# Altium schematic sheet Nixie tester.SchDoc: IN-18 Nixie Tube Tester
size 297 x 209 mm; SheetNumber: 1; SheetTotal: 1
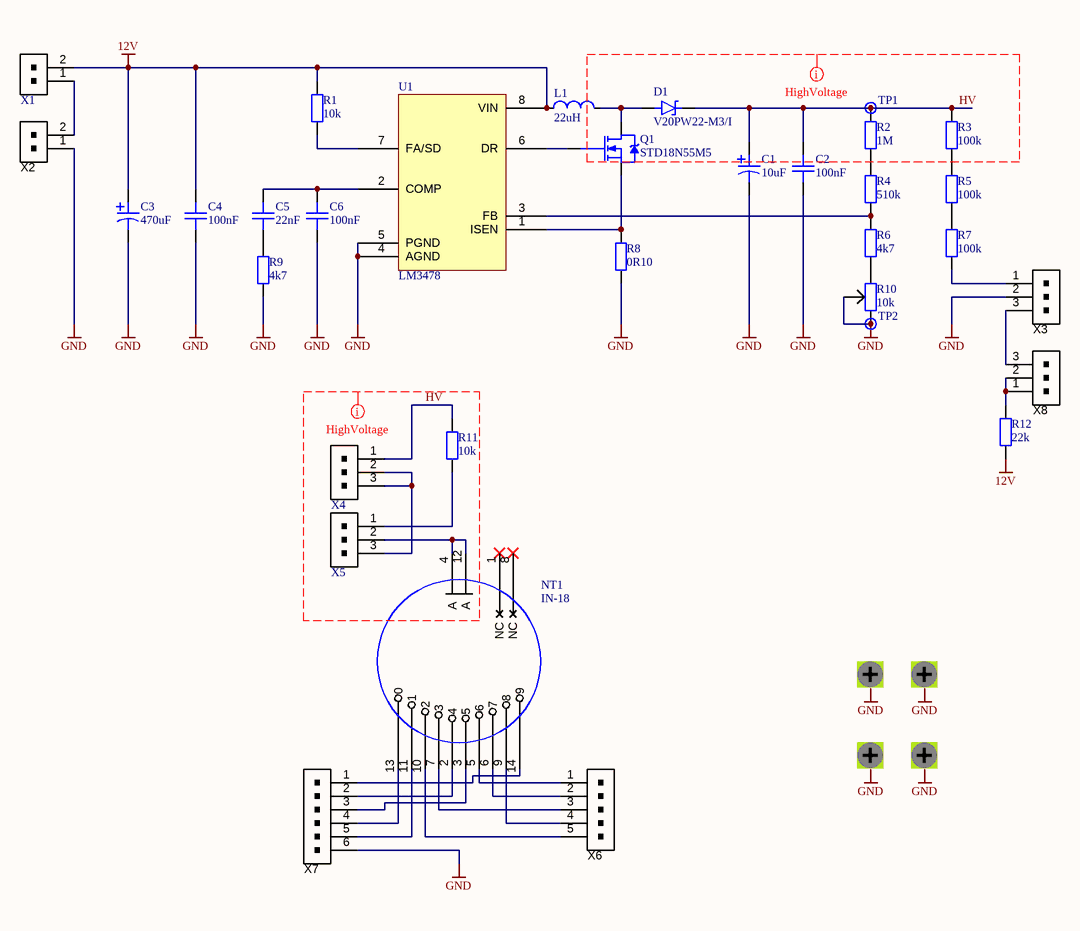
[diagram p0: Nixie tester.SchDoc]

## Parts
C1  10uF  [CAP-ELCO-10mm-laying THT]
C2  100nF  [CAP-1206]
C3  470uF  [CAP-Panasonic]
C4  100nF  [CAP-0805]
C5  22nF  [CAP-0603]
C6  100nF  [CAP-0603]
D1  V20PW22-M3/I  [D-DPAK (diode)]
L1  22uH  [IND-SMD-12.7x12.7mm]
MH1  MECH - M2 screw  [MECH-M2 - large pad]  (value not drawn)
MH2  MECH - M2 screw  [MECH-M2 - large pad]  (value not drawn)
MH3  MECH - M2 screw  [MECH-M2 - large pad]  (value not drawn)
MH4  MECH - M2 screw  [MECH-M2 - large pad]  (value not drawn)
NT1  IN-18  [VT-IN-18 - no silk screen]
Q1  STD18N55M5  [D-DPAK]
R1  10k  [RES-0603]
R2  1M  [RES-0805]
R3  100k  [RES-0603]
R4  510k  [RES-0805]
R5  100k  [RES-0603]
R6  4k7  [RES-0805]
R7  100k  [RES-0603]
R8  0R10  [RES-2512]
R9  4k7  [RES-0603]
R10  10k  [RES-TRIM-THT]
R11  10k  [RES-1206]
R12  22k  [RES-0603]
TP1  MISC - Testpoint SMT  [MISC-TESTPOINT-SMT]  (value not drawn)  (no BOM)
TP2  MISC - Testpoint SMT  [MISC-TESTPOINT-SMT]  (value not drawn)  (no BOM)
U1  LM3478  [IC-SOIC-8]
X1  CONN - 2P -THT-JST 2.00mm  [CONN-2P-THT-STRAIGHT-JST 2.00mm]  (value not drawn)
X2  CONN - PWR  [CONN-POWER]  (value not drawn)
X3  CONN - 3P - THT-JST 1.5mm  [CONN-3P-THT-JST 1.5mm]  (value not drawn)
X4  CONN - 3P -THT-JST 2.5mm  [CONN-3P-THT-STRAIGHT-JST 2.5mm]  (value not drawn)
X5  CONN - 3P -THT-JST 2.5mm  [CONN-3P-THT-STRAIGHT-JST 2.5mm]  (value not drawn)
X6  CONN - 5P - THT-JST 1.5mm  [CONN-5P-THT-STRAIGHT-JST 1.5mm]  (value not drawn)
X7  CONN - 6P - THT-JST 1.5mm  [CONN-6P-THT-STRAIGHT-JST 1.5mm]  (value not drawn)
X8  CONN - 3P - THT-JST 1.5mm  [CONN-3P-THT-JST 1.5mm]  (value not drawn)

## Nets
12V: C3.2 C4.2 L1.1 R1.2 R12.1 U1.8(VIN) X1.2
GND: C1.1 C2.1 C3.1 C4.1 C6.1 MH1.MH(Con) MH2.MH(Con) MH3.MH(Con) MH4.MH(Con) R8.1 R9.1 R10.2 R10.3 TP2.1 U1.4(AGND) U1.5(PGND) X2.1 X3.2 X7.6
HV: C1.2 C2.2 D1.2 R2.2 R3.2 R11.2 TP1.1 X4.1
NetC5_1: C5.1 R9.2
NetC5_2: C5.2 C6.2 U1.2(COMP)
NetD1_1: D1.1 L1.2 Q1.3(D)
NetNT1_2: NT1.2(4) X7.2
NetNT1_3: NT1.3(5) X7.3
NetNT1_4: NT1.4(A) NT1.12(A) X5.2
NetNT1_5: NT1.5(6) X6.1
NetNT1_6: NT1.6(7) X6.2
NetNT1_7: NT1.7(3) X6.3
NetNT1_9: NT1.9(8) X6.4
NetNT1_10: NT1.10(2) X6.5
NetNT1_11: NT1.11(1) X7.5
NetNT1_13: NT1.13(0) X7.4
NetNT1_14: NT1.14(9) X7.1
NetQ1_1: Q1.1(G) U1.6(DR)
NetQ1_2: Q1.2(S) R8.2 U1.1(ISEN)
NetR1_1: R1.1 U1.7(FA/SD)
NetR2_1: R2.1 R4.2
NetR3_1: R3.1 R5.2
NetR4_1: R4.1 R6.2 U1.3(FB)
NetR5_1: R5.1 R7.2
NetR6_1: R6.1 R10.1
NetR7_1: R7.1 X3.1
NetR11_1: R11.1 X5.1
NetR12_2: R12.2 X8.1 X8.2
NetX1_1: X1.1 X2.2
NetX3_3: X3.3 X8.3
NetX4_2: X4.2 X4.3 X5.3

Not connected (* = marked no-connect by the designer): NT1 1(NC)* 8(NC)*

## Layout directives
net class HighVoltage: HV

## Notes on the sheet
- PROJECT NAME
- DATE
- TITLE
- TIME
- VERSION CONTROL
- N/A
- SIZE
- SCALE:
- A4
- FILE NAME
- DWG NO.
- SHEET
- REV
- OF
- DRAWN BY:

## Library data of the parts
C1 = CAP - THT - 10mm: Capacitor Polar; Distributor: Lomex; Order number: 12-18-87; Value: 10uF
C2 = CAP - 1206: Capacitor Non-Polar; Value: 100nF; Distributor: *; Order number: *
C3 = CAP - SMD - POL: Capacitor Polar; Distributor: *; Order number: *; Value: 470uF
C4 = CAP - 0805: Capacitor Non-Polar; Value: 100nF; Distributor: *; Order number: *
C5 C6 = CAP - 0603: Capacitor Non-Polar; Distributor: *; Order number: *
  C5: Value: 22nF
  C6: Value: 100nF
D1 = D - V20PW22: Schottky Rectifier, 200 V, 20 A, Single, TO-252AE, 3 Pins, 960 mV; Order number: 3514270; PartNumber: V20PW22-M3/I; Distributor: Farnell; Supplier 1: Farnell; Supplier Part Number 1: 3514270
L1 = IND - SMD: 12.7x12.7mm choke inductor; Value: 22uH; Distributor: *; Order number: *
MH1-MH4 = MECH - M2 screw: M3 hole with screw; Distributor: *; Order number: *
NT1 = VT - IN-18: Numeric nixie tube; Distributor: *; Order number: *
Q1 = T - STD18N55M5: power N-FET; Value: STD18N55M5; Distributor: *; Order number: *
R1 R3 R5 R7 R9 R12 = RES - 0603: Resistor; Distributor: *; Order number: *
  R1: Value: 10k
  R3 R5 R7: Value: 100k
  R9: Value: 4k7
  R12: Value: 22k
R2 R4 R6 = RES - 0805: Resistor; Distributor: *; Order number: *
  R2: Value: 1M
  R4: Value: 510k
  R6: Value: 4k7
R8 = RES - 2512: Resistor; Value: 0R10; Distributor: *; Order number: *
R10 = RES - POT - TRIM - THT: Trim Potentiometer; Distributor: *; Order number: *; Value: 10k
R11 = RES - 1206: Resistor; Value: 10k; Distributor: *; Order number: *
TP1 TP2 = MISC - Testpoint SMT: SMT testpoint
U1 = IC - LM3478: 2.97~40V Wide Input Range Boost/SEPIC/Flyback DC-DC Controller; Distributor: *; Order number: *; Supplier 1: Digi-Key; Supplier Part Number 1: 296-38111-1-ND
X1 = CONN - 2P -THT-JST 2.00mm: 1x2 pin THT connector; Order number: 100.385.23; 100.341.10; Distributor: Hestore
X2 = CONN - PWR: 5.5/2.1/9.5mm DC táp, anya; Distributor: Lomex; Order number: 43-07-67
X3 X8 = CONN - 3P - THT-JST 1.5mm: 1x3 pin header; Distributor: *; Order number: *
X4 X5 = CONN - 3P -THT-JST 2.5mm: 1x3 pin THT connector; Order number: 100.415.49; 100.351.20; Distributor: Hestore
X6 = CONN - 5P - THT-JST 1.5mm: 1x5 pin header; Order number: 100.464.50; 100.432.13; 100.368.81; Distributor: Hestore
X7 = CONN - 6P - THT-JST 1.5mm: 1x6 pin header; Order number: 100.464.52; 100.386.37; 100.368.81; Distributor: Hestore